# Altium schematic sheet Overview.SchDoc
size A4; SheetNumber: 1; SheetTotal: 6
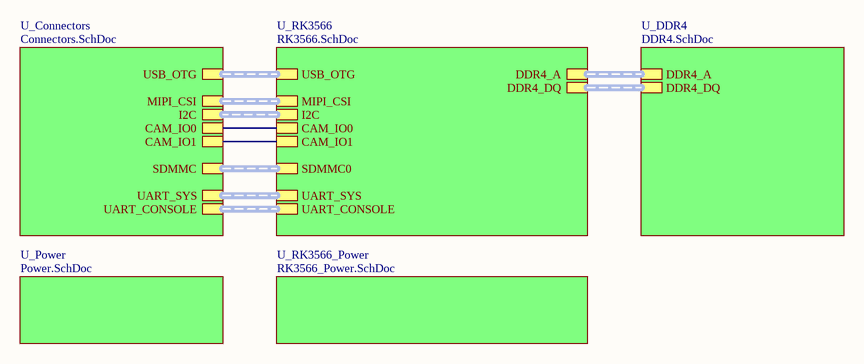
[diagram p0: Overview.SchDoc]

## Sub-sheets
U_Connectors = Connectors.SchDoc: USB_OTG (harness USB_OTG), MIPI_CSI (harness MIPI_CSI), I2C (harness I2C), CAM_IO0, CAM_IO1, SDMMC (harness SDMMC), UART_SYS (harness UART), UART_CONSOLE (harness UART)
U_DDR4 = DDR4.SchDoc: DDR4_A (harness DDR4_A), DDR4_DQ (harness DDR4_DQ)
U_Power = Power.SchDoc: no entries
U_RK3566 = RK3566.SchDoc: MIPI_CSI (harness MIPI_CSI), SDMMC0 (harness SDMMC0), I2C (harness I2C), USB_OTG (harness USB_OTG), DDR4_DQ (harness DDR4_DQ), DDR4_A (harness DDR4_ACC), UART_SYS (harness UART_SYS), UART_CONSOLE (harness UART_CONSOLE), CAM_IO0, CAM_IO1
U_RK3566_Power = RK3566_Power.SchDoc: no entries

## Nets
(unnamed): sheet U_RK3566/CAM_IO0, sheet U_Connectors/CAM_IO0
(unnamed): sheet U_RK3566/CAM_IO1, sheet U_Connectors/CAM_IO1

## Buses and harness runs
harness sheet U_Connectors/I2C = sheet U_RK3566/I2C
harness sheet U_Connectors/MIPI_CSI = sheet U_RK3566/MIPI_CSI
harness sheet U_Connectors/SDMMC = sheet U_RK3566/SDMMC0
harness sheet U_Connectors/UART_CONSOLE = sheet U_RK3566/UART_CONSOLE
harness sheet U_Connectors/UART_SYS = sheet U_RK3566/UART_SYS
harness sheet U_Connectors/USB_OTG = sheet U_RK3566/USB_OTG
harness sheet U_DDR4/DDR4_A = sheet U_RK3566/DDR4_A
harness sheet U_DDR4/DDR4_DQ = sheet U_RK3566/DDR4_DQ